# EAGLE design stm32hw07 (EAGLE 9.6.2)
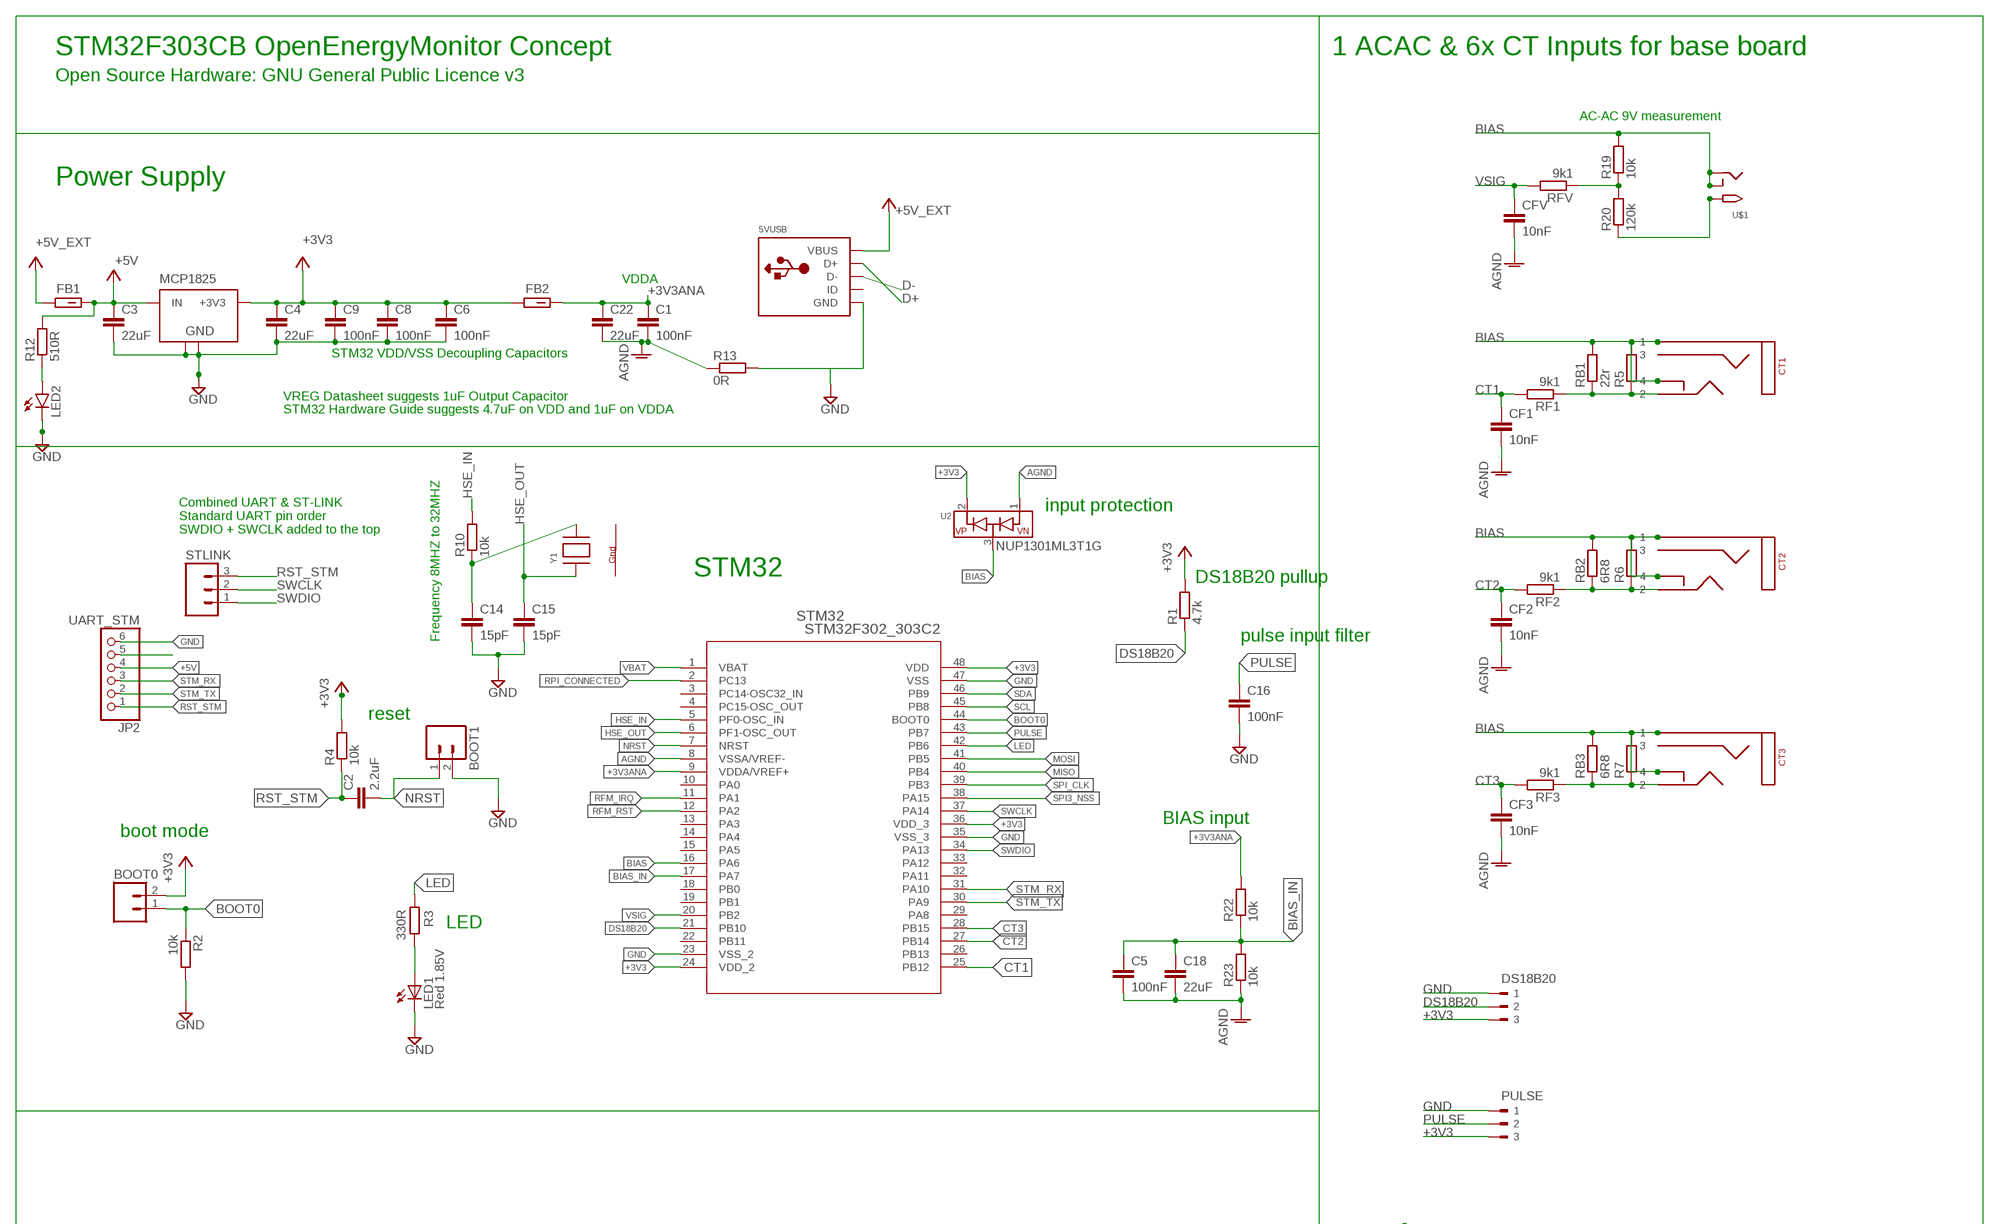
[diagram p0: schematic, sheet 1, part 1 of 3]
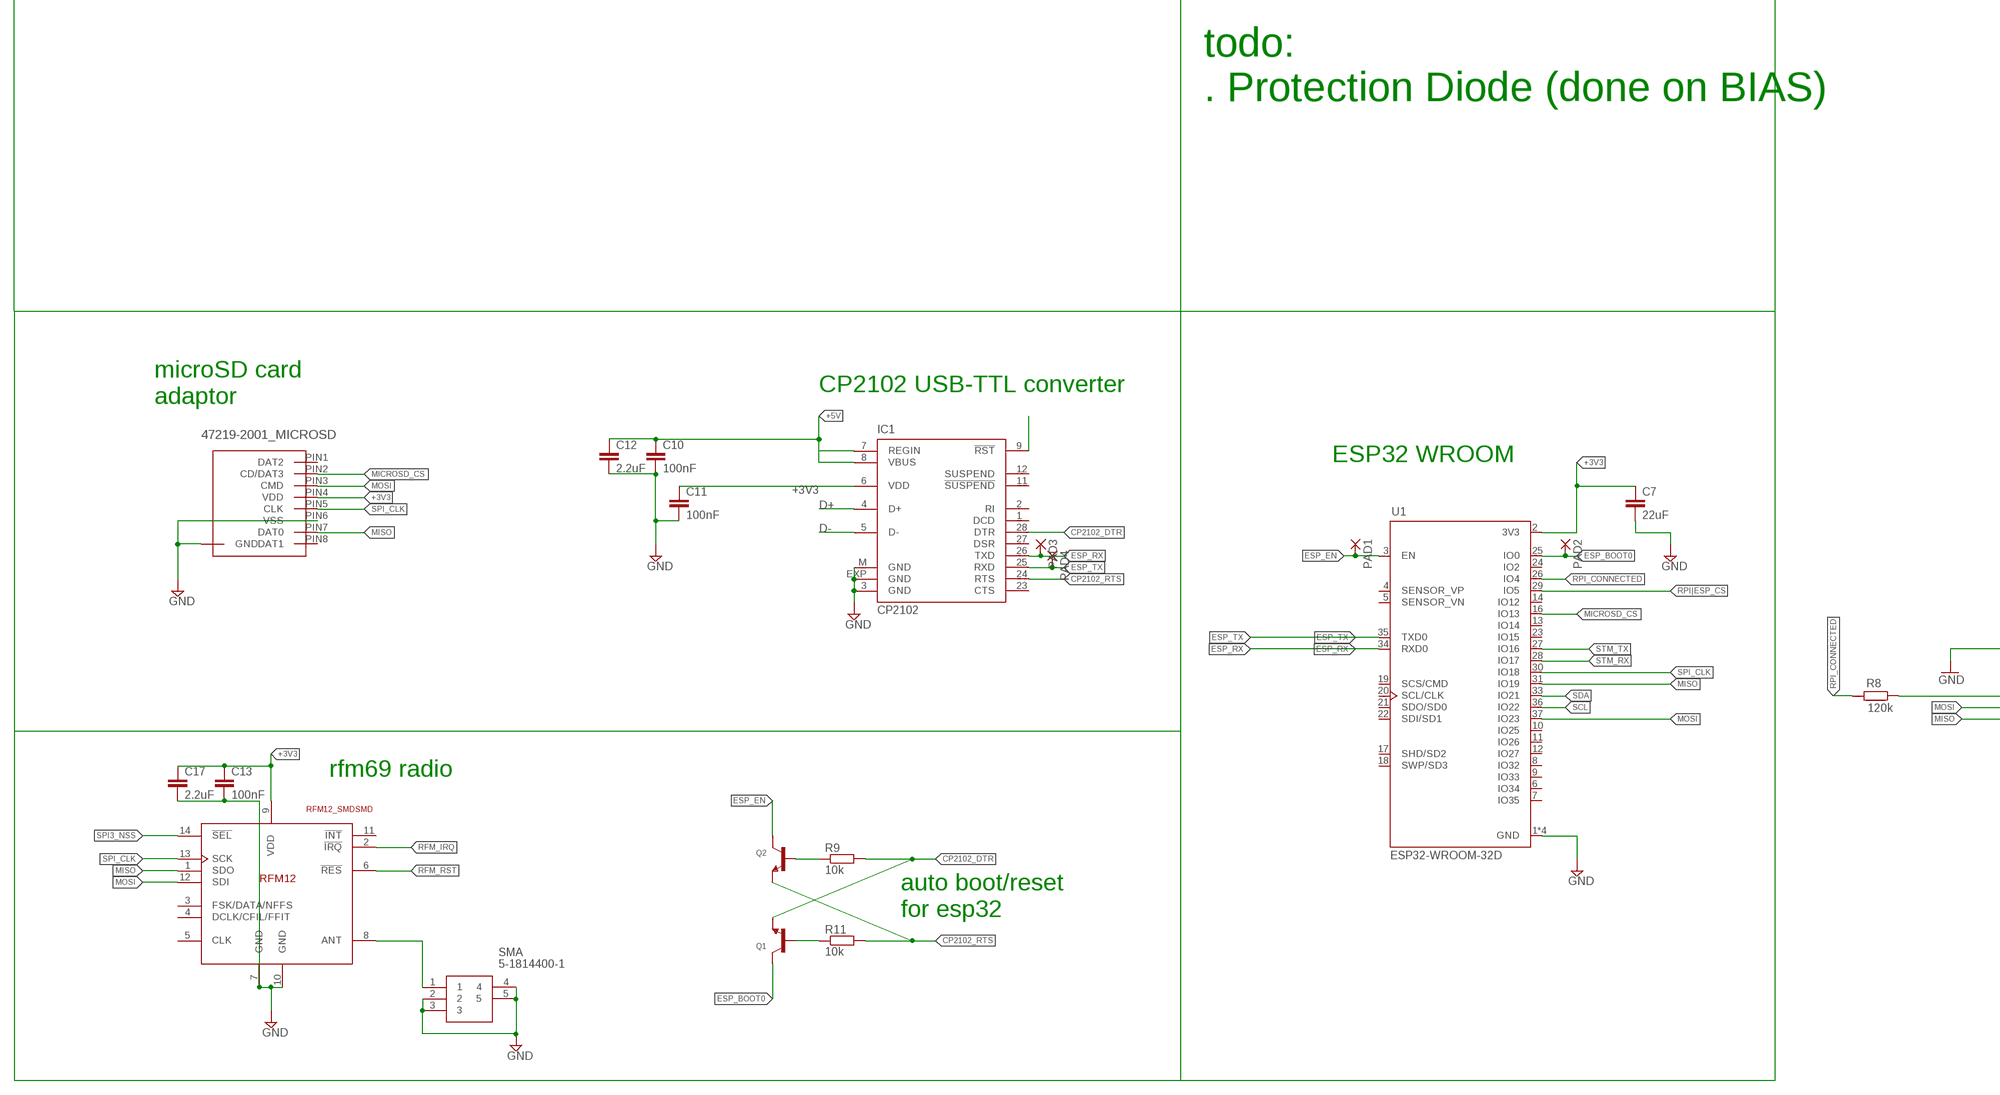
[diagram p1: schematic, sheet 1, part 2 of 3]
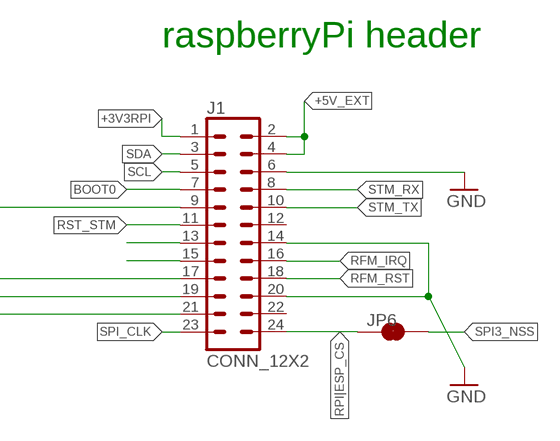
[diagram p2: schematic, sheet 1, part 3 of 3]

## Parts
5VUSB  USBMOLEX  [USB-MINIB-THM-MOLEX]
BOOT0  M02PTH  [1X02]
BOOT1  M02PTH  [1X02]
C1  100nF  C-EUC0603  [C0603]
C2  2.2uF  C-EUC0603  [C0603]
C3  22uF  C-EUC0805  [C0805]
C4  22uF  C-EUC0805  [C0805]
C5  100nF  C-EUC0603  [C0603]
C6  100nF  C-EUC0603  [C0603]
C7  22uF  C-EUC0805  [C0805]
C8  100nF  C-EUC0603  [C0603]
C9  100nF  C-EUC0603  [C0603]
C10  100nF  C-EUC0603  [C0603]
C11  100nF  C-EUC0603  [C0603]
C12  2.2uF  C-EUC0603  [C0603]
C13  100nF  C-EUC0603  [C0603]
C14  15pF  C-EUC0603  [C0603]
C15  15pF  C-EUC0603  [C0603]
C16  100nF  C-EUC0603  [C0603]
C17  2.2uF  C-EUC0603  [C0603]
C18  22uF  C-EUC0805  [C0805]
C22  22uF  C-EUC0805  [C0805]
CF1  10nF  C-EUC0805  [C0805]
CF2  10nF  C-EUC0805  [C0805]
CF3  10nF  C-EUC0805  [C0805]
CFV  10nF  C-EUC0805  [C0805]
CT1  STEREO_SMD  [STEREO_SMT]
CT2  STEREO_SMD  [STEREO_SMT]
CT3  STEREO_SMD  [STEREO_SMT]
DS18B20  180-3  [180-3]
FB1  0R  FBCHIP-0603(1608-METRIC)  [BEADC1608X95N]
FB2  0R  FBCHIP-0603(1608-METRIC)  [BEADC1608X95N]
IC1  CP2102  [MLP28]
J1  CONN_12X2  [2X12]
JP2  UART_STM  PINHD-1X6  [1X06]
JP6  JUMPER-SMT_2_NC_TRACE_NO-SILK  [SMT-JUMPER_2_NC_TRACE_NO-SILK]
LED1  Red 1.85V  LEDCHIP-LED0805  [CHIP-LED0805]
LED2  LEDCHIP-LED0805  [CHIP-LED0805]
MCP1825  MCP1825SOT-223-3  [SOT-223]
PAD1  1,6/0,8  [1,6/0,8]
PAD2  1,6/0,8  [1,6/0,8]
PAD3  1,6/0,8  [1,6/0,8]
PAD4  1,6/0,8  [1,6/0,8]
PULSE  180-3  [180-3]
Q1  TRANSISTOR_NPN  [SOT23-R]
Q2  TRANSISTOR_NPN  [SOT23-R]
R1  4.7k  R-EU_R0603  [R0603]
R2  10k  R-EU_R0603  [R0603]
R3  330R  R-EU_R0603  [R0603]
R4  10k  R-EU_R0603  [R0603]
R5  R-EU_0207/10  [0207/10]
R6  R-EU_0207/10  [0207/10]
R7  R-EU_0207/10  [0207/10]
R8  120k  R-EU_R0603  [R0603]
R9  10k  R-EU_R0603  [R0603]
R10  10k  R-EU_R0603  [R0603]
R11  10k  R-EU_R0603  [R0603]
R12  510R  R-EU_R0603  [R0603]
R13  0R  R-EU_R0603  [R0603]
R19  10k  R-EU_R0603  [R0603]
R20  120k  R-EU_R0603  [R0603]
R22  10k  R-EU_R0603  [R0603]
R23  10k  R-EU_R0603  [R0603]
RB1  22r  R-EU_R0603  [R0603]
RB2  6R8  R-EU_R0603  [R0603]
RB3  6R8  R-EU_R0603  [R0603]
RF1  9k1  R-EU_R0603  [R0603]
RF2  9k1  R-EU_R0603  [R0603]
RF3  9k1  R-EU_R0603  [R0603]
RFV  9k1  R-EU_R0603  [R0603]
SMA  5-1814400-1  [518144001]
STLINK  M03PTH  [1X03]
STM32  STM32F302_303C2  [LQFP48-7X7MM]
U1  ESP32-WROOM-32D  [MODULE_ESP32-WROOM-32D]
U2  ESDDIODEARRAY_SINGLE_UNIDIR  [SOT23-WIDE]
U$1  2.1MMJACKSMT  [DCJACK_2MM_SMT]
U$2  RFM12_SMDSMD  [RFM12]
U$3  47219-2001_MICROSD  [47219-2001_MICROSD]
Y1  XTAL-4-3225  [NX3225]

## Nets
+3V3: BOOT0.2 C4.1 C6.1 C7.1 C8.1 C9.1 C11.1 C13.1 C17.1 DS18B20.3 FB2.1 IC1.6(VDD) MCP1825.3(+3V3) PULSE.3 R1.2 R4.2 STM32.24(VDD_2) STM32.36(VDD_3) STM32.48(VDD) U1.2(3V3) U2.2(SUPPLYPIN) U$2.9(VDD) U$3.PIN4(VDD)
+3V3ANA: C1.1 C22.1 FB2.2 R22.2 STM32.9(VDDA/VREF+)
+3V3RPI: J1.1
+5V: C3.1 C10.1 C12.1 FB1.2 IC1.7(REGIN) IC1.8(VBUS) JP2.4 MCP1825.1(IN) R12.2
+5V_EXT: 5VUSB.VBUS FB1.1 J1.2 J1.4 ; supply symbol labelled +5V
AC: R20.1 U$1.PWR2(TIP)
ADC0: R19.1 R20.2 RFV.1
AGND: C1.2 C5.2 C18.2 C22.2 CF1.2 CF2.2 CF3.2 CFV.2 R13.1 R23.1 STM32.8(VSSA/VREF-) U2.1(GNDPIN)
BIAS: CT1.P$1 CT1.P$4 CT2.P$1 CT2.P$4 CT3.P$1 CT3.P$4 R5.2 R6.2 R7.2 R19.2 RB1.2 RB2.2 RB3.2 STM32.16(PA6) U2.3(IO) U$1.GND(RING) U$1.GNDBREAK(RING_SW)
BIAS_IN: C5.1 C18.1 R22.1 R23.2 STM32.17(PA7)
BOOT0: BOOT0.1 J1.7 R2.1 STM32.44(BOOT0)
CP2102_DTR: IC1.28(DTR) Q1.2(E) R9.2
CP2102_RTS: IC1.24(RTS) Q2.2(E) R11.2
CT1: CF1.1 RF1.2 STM32.25(PB12)
CT2: CF2.1 RF2.2 STM32.27(PB14)
CT3: CF3.1 RF3.2 STM32.28(PB15)
D+: 5VUSB.D+ IC1.4(D+)
D-: 5VUSB.D- IC1.5(D-)
DS18B20: DS18B20.2 R1.1 STM32.21(PB10)
ESP_BOOT0: PAD2.1(P) Q1.3(C) U1.25(IO0)
ESP_EN: PAD1.1(P) Q2.3(C) U1.3(EN)
ESP_RX: IC1.26(TXD) PAD3.1(P) U1.34(RXD0)
ESP_TX: IC1.25(RXD) PAD4.1(P) U1.35(TXD0)
GND: 5VUSB.GND BOOT1.2 C3.2 C4.2 C6.2 C7.2 C8.2 C9.2 C10.2 C11.2 C12.2 C13.2 C14.2 C15.2 C16.2 C17.2 DS18B20.1 IC1.3(GND) IC1.EXP(GND) IC1.M(GND) J1.6 J1.14 J1.20 JP2.6 LED1.C LED2.C MCP1825.2(GND) MCP1825.4(GND) PULSE.1 R2.2 R13.2 SMA.2 SMA.3 SMA.4 SMA.5 STM32.23(VSS_2) STM32.35(VSS_3) STM32.47(VSS) U1.1(GND) U1.15(GND) U1.38(GND) U1.39(GND) U$2.7(GND) U$2.10(GND) U$3.P$1(GND) U$3.P$2(GND) U$3.P$3(GND) U$3.P$4(GND) U$3.PIN6(VSS)
HSE_IN: R10.2 STM32.5(PF0-OSC_IN)
HSE_IN_: C14.1 R10.1 Y1.3(X2)
HSE_OUT: C15.1 STM32.6(PF1-OSC_OUT) Y1.1(X1)
LED: R3.2 STM32.42(PB6)
MICROSD_CS: U1.16(IO13) U$3.PIN2(CD/DAT3)
MISO: J1.21 STM32.40(PB4) U1.31(IO19) U$2.1(SDO) U$3.PIN7(DAT0)
MOSI: J1.19 STM32.41(PB5) U1.37(IO23) U$2.12(SDI) U$3.PIN3(CMD)
N$1: IC1.9(!RST)
N$2: CT1.P$2 R5.1 RB1.1 RF1.1
N$5: J1.9 ; supply symbol labelled GND
N$6: Q2.1(B) R9.1
N$7: Q1.1(B) R11.1
N$8: CT2.P$2 R6.1 RB2.1 RF2.1
N$9: J1.15
N$10: CT3.P$2 R7.1 RB3.1 RF3.1
N$11: J1.13
N$13: LED2.A R12.1
N$18: SMA.1 U$2.8(ANT)
N$19: JP2.5
N$41: LED1.A R3.1
NRST: BOOT1.1 C2.2 STM32.7(NRST)
PULSE: C16.1 PULSE.2 STM32.43(PB7)
RFM_IRQ: J1.16 STM32.11(PA1) U$2.2(!IRQ)
RFM_RST: J1.18 STM32.12(PA2) U$2.6(!RES)
RPI_CONNECTED: R8.2 STM32.2(PC13) U1.26(IO4)
RPI_CONNECTED_PR: J1.17 R8.1
RPI|ESP_CS: J1.24 JP6.1 U1.29(IO5)
RST_STM: C2.1 J1.11 JP2.1 R4.1 STLINK.3
SCL: J1.5 STM32.45(PB8) U1.36(IO22)
SDA: J1.3 STM32.46(PB9) U1.33(IO21)
SPI3_NSS: JP6.2 STM32.38(PA15) U$2.14(!SEL)
SPI_CLK: J1.23 STM32.39(PB3) U1.30(IO18) U$2.13(SCK) U$3.PIN5(CLK)
STM_RX: J1.8 JP2.3 STM32.31(PA10) U1.28(IO17)
STM_TX: J1.10 JP2.2 STM32.30(PA9) U1.27(IO16)
SWCLK: STLINK.2 STM32.37(PA14)
SWDIO: STLINK.1 STM32.34(PA13)
VBAT: STM32.1(VBAT)
VSIG: CFV.1 RFV.2 STM32.20(PB2)
Unconnected: 5VUSB.ID CT1.P$3 CT2.P$3 CT3.P$3 IC1.1(DCD) IC1.2(RI) IC1.11(!SUSPEND) IC1.12(SUSPEND) IC1.23(CTS) IC1.27(DSR) J1.12 J1.22 STM32.3(PC14-OSC32_IN) STM32.4(PC15-OSC_OUT) STM32.10(PA0) STM32.13(PA3) STM32.14(PA4) STM32.15(PA5) STM32.18(PB0) STM32.19(PB1) STM32.22(PB11) STM32.26(PB13) STM32.29(PA8) STM32.32(PA11) STM32.33(PA12) U1.4(SENSOR_VP) U1.5(SENSOR_VN) U1.6(IO34) U1.7(IO35) U1.8(IO32) U1.9(IO33) U1.10(IO25) U1.11(IO26) U1.12(IO27) U1.13(IO14) U1.14(IO12) U1.17(SHD/SD2) U1.18(SWP/SD3) U1.19(SCS/CMD) U1.20(SCL/CLK) U1.21(SDO/SD0) U1.22(SDI/SD1) U1.23(IO15) U1.24(IO2) U$2.3(FSK/DATA/NFFS) U$2.4(DCLK/CFIL/FFIT) U$2.5(CLK) U$2.11(!INT) U$3.PIN1(DAT2) U$3.PIN8(DAT1)

## Notes on the sheet
- STM32F303CB OpenEnergyMonitor Concept | 1 ACAC & 6x CT Inputs for base board
- Open Source Hardware: GNU General Public Licence v3
- AC-AC 9V measurement
- Power Supply
- VDDA
- STM32 VDD/VSS Decoupling Capacitors
- VREG Datasheet suggests 1uF Output Capacitor
- STM32 Hardware Guide suggests 4.7uF on VDD and 1uF on VDDA
- input protection
- Combined UART & ST-LINK
  Standard UART pin order
  SWDIO + SWCLK added to the top
- STM32
- DS18B20 pullup
- Frequency 8MHZ to 32MHZ | pulse input filter
- reset
- BIAS input
- boot mode
- LED
- todo:
  . Protection Diode (done on BIAS)
- CP2102 USB-TTL converter
- microSD card
  adaptor
- ESP32 WROOM
- raspberryPi header
- rfm69 radio
- auto boot/reset
  for esp32

## Power pins joined to a net without a drawn wire
G1: Y1.4(G1)
G2: Y1.2(G2)

## Library data of the parts
5VUSB = adafruit:USB: USB Connectors USBMINIB - Surface Mount Female Mini-B USB Connector 4UConnector: 06564 By microbuilder.eu Thru-hole RA Female Mini-B USB Connector 4UConnector: 18732 By ladyada.net
BOOT0 BOOT1 = SparkFun:M02: Header 2 Standard 2-pin 0.1" header. Use with straight break away headers (SKU : PRT-00116), right angle break away headers (PRT-00553), swiss pins (PRT-00743), machine pins (PRT-00117), and female headers (PRT-00115). Molex polarized connector foot print use with SKU : PRT-08233 with associated crimp pins and housings.
C1 C2 C5 C6 C8 C9 C14-C16 = resistor:C-EU: CAPACITOR, European symbol
C3 C4 C7 C10-C13 C17 C18 C22 CF1-CF3 CFV = rcl:C-EU: CAPACITOR, European symbol; SPICEPREFIX: C
CT1-CT3 = IotaWatt_parts:STEREO_SMD: 3.5mm Stereo Jack SMT
DS18B20 PULSE = con-weidmueller-sl35:180-3: WEIDMUELLER CLAMP CONNECTOR; OC_FARNELL: unknown; OC_NEWARK: unknown
FB1 FB2 = Filter:FB: Ferrite Bead - Generic; CATEGORY: Filter; SUB-CATEGORY: Ferrite bead
IC1 = silabs:CP210*: Single-Chip USB to UART Bridge Source: www.silabs.com .. CP2101.pdf / cp2102.pdf; MF: FARNELL; MPN: CP2102-GM; OC_FARNELL: 9282130; OC_NEWARK: 30K5635
J1 = SparkFun-Connectors:CONN_12X2: Multi connection point. Often used as Generic Header-pin footprint for 0.1 inch spaced/style header connections On any of the 0.1 inch spaced packages, you can populate with these: Break Away Headers - Straight <https://www.sparkfun.com/products/116> (PRT-00116) Break Away Male Headers - Right Angle <https://www.sparkfun.com/products/553> (PRT-00553) Female Headers <https://www.sparkfun.com/products/115> (PRT-00115) Break Away Headers - Machine Pin <https://www.sparkfun.com/products/117> (PRT-00117) Break Away Female Headers - Swiss Machine Pin <https://www.sparkfun.com/products/743> (PRT-00743)
JP2 = Connector:PINHD-1X6: PIN HEADER; CATEGORY: CONNECTOR; SUB-CATEGORY: PIN-HEADER
JP6 = SparkFun-Jumpers:JUMPER-SMT_2_NC_TRACE: Normally closed trace jumper This jumper has a trace between two pads so it's normally closed (NC). Use a razor knife to open the connection. For best results follow the IPC guidelines for cutting traces: Cutout at least 0.063 mm (0.005 in). Remove all loose material to clean up the cut area. Seal the cut with an approved epoxy. Reapply solder to reclose the connection.
LED1 = adafruit:LED: LED
LED2 = led:LED: LED
MCP1825 = SteelCaveRobotics-Power:MCP1825: MCP1825 3.3v LDO Linear Regulator
PAD1-PAD4 = wirepad:1,6/0,8: THROUGH-HOLE PAD
Q1 Q2 = microbuilder:TRANSISTOR_NPN: NPN Transistor Transistor (NPN) 500mA 45V - BC817 [Digikey: 568-1631-1-ND] Transistor (NPN) 500mA 45V - BC817,215 [Mouser: 771-BC817-T/R] SOT23-R - SOT23 footprint optimised for use with solder paste and reflow ovens. SOT23-W - SOT23 footprint optimised for hand-soldering (larger pads).
R1 R2 R4 R9-R13 R19 R20 R22 R23 RB1-RB3 RF1-RF3 RFV = resistor:R-EU_: RESISTOR, European symbol
R3 R8 = rcl:R-EU_: RESISTOR, European symbol
R5-R7 = rcl:R-EU_: RESISTOR, European symbol; SPICEPREFIX: R
SMA = 5-1814400-1 sma connector:5-1814400-1: SMA Connector Jack, Female Socket 50 Ohm Through Hole, Right Angle Solder Source: Datasheet <http://uk.rs-online.com/web/p/products/6163400>; ALLIED_NUMBER: 70084631; DESCRIPTION: SMA Connector Jack, Female Socket 50 Ohm Through Hole, Right Angle Solder; HEIGHT: 10.43mm; MANUFACTURER_NAME: TE Connectivity; MANUFACTURER_PART_NUMBER: 5-1814400-1; RS_PART_NUMBER: 6163400; RS_PRICE-STOCK: http://uk.rs-online.com/web/p/products/6163400
STLINK = SparkFun:M03: Header 3 Standard 3-pin 0.1" header. Use with straight break away headers (SKU : PRT-00116), right angle break away headers (PRT-00553), swiss pins (PRT-00743), machine pins (PRT-00117), and female headers (PRT-00115). Molex polarized connector foot print use with SKU : PRT-08232 with associated crimp pins and housings.
STM32 = stm32f303cb:STM32F302_303C2; MANUFACTURER_PART_NUMBER: stm32f302_303c2; VENDOR: STMicroelectronics
U1 = ESP32-WROOM-32D:ESP32-WROOM-32D: IC: SoC; GPIO, I2C, I2S, IR, SD, SDIO, SPI, UART; 2.7÷3.6VDC; 20dBm; AVAILABILITY: Unavailable; DESCRIPTION: IC: SoC; GPIO, I2C, I2S, IR, SD, SDIO, SPI, UART; 2.7÷3.6VDC; 20dBm; MF: Espressif Systems; MP: ESP32-WROOM-32D; PACKAGE: Module Espressif Systems; PRICE: None
U2 = microbuilder:ESDDIODEARRAY_SINGLE_UNIDIR: ESD Protection Diode Array - Single Channel Unidirectional SOT23-3 NUP1301,215 - Ultra low capacitance (0.6pF), Rev Voltage 80V, Forward Current: 215mA - Digikey: 568-6351-1-ND; MPN: NUP1301ML3T1G
U$1 = adafruit:2.1MMJACK: 2.1mm x 5.5mm THM DC jack with internal switch. Digikey part #PJ-102A, 4UCON part #05537 2.1mm x 5.5mm SMT DC jack with internal switch. Digikey part #PJ-002A-SMT, 4UCON part #03267 By microbuilder.eu & adafruit.com
U$2 = rfm12b _ rfm69cw:RFM12_SMD: RFM12 is a low costing ISM band transceiver module implemented with unique PLL. It works signal ranges from 315/433/868/915MHZ bands, comply with FCC, ETSI regulation. The SPI interface is used to communicate with microcontroller for parameter setting.
U$3 = MOLEX 47219-2001:47219-2001_MICROSD
Y1 = adafruit:XTAL-4: Classic 4-pin 3.2 x 2.5mm crystal

## Net classes
0 default: width 0.203 mm, drill 0.5 mm, clearance 0.152 mm
1 power: width 0.381 mm, drill 0.5 mm, clearance 0.254 mm
2 gnd: width 0.254 mm, drill 0.5 mm, clearance 0.254 mm

## Board
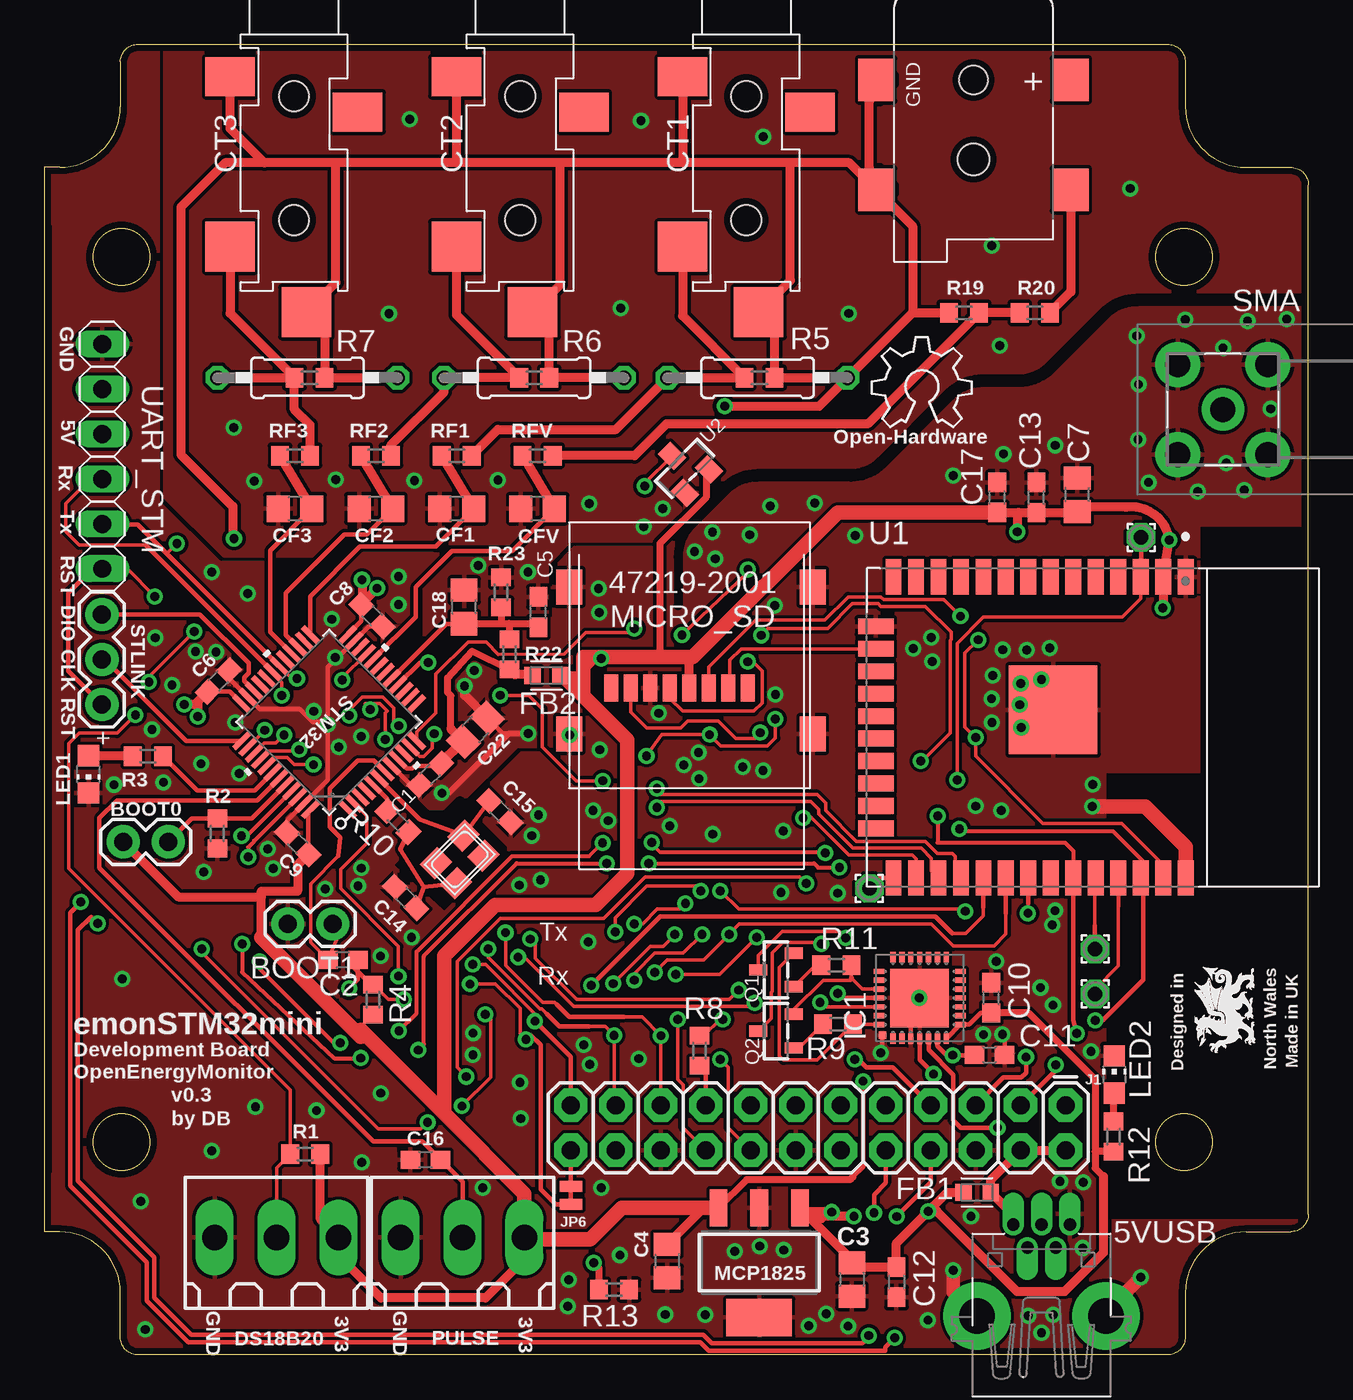
[diagram p3: board, top side]
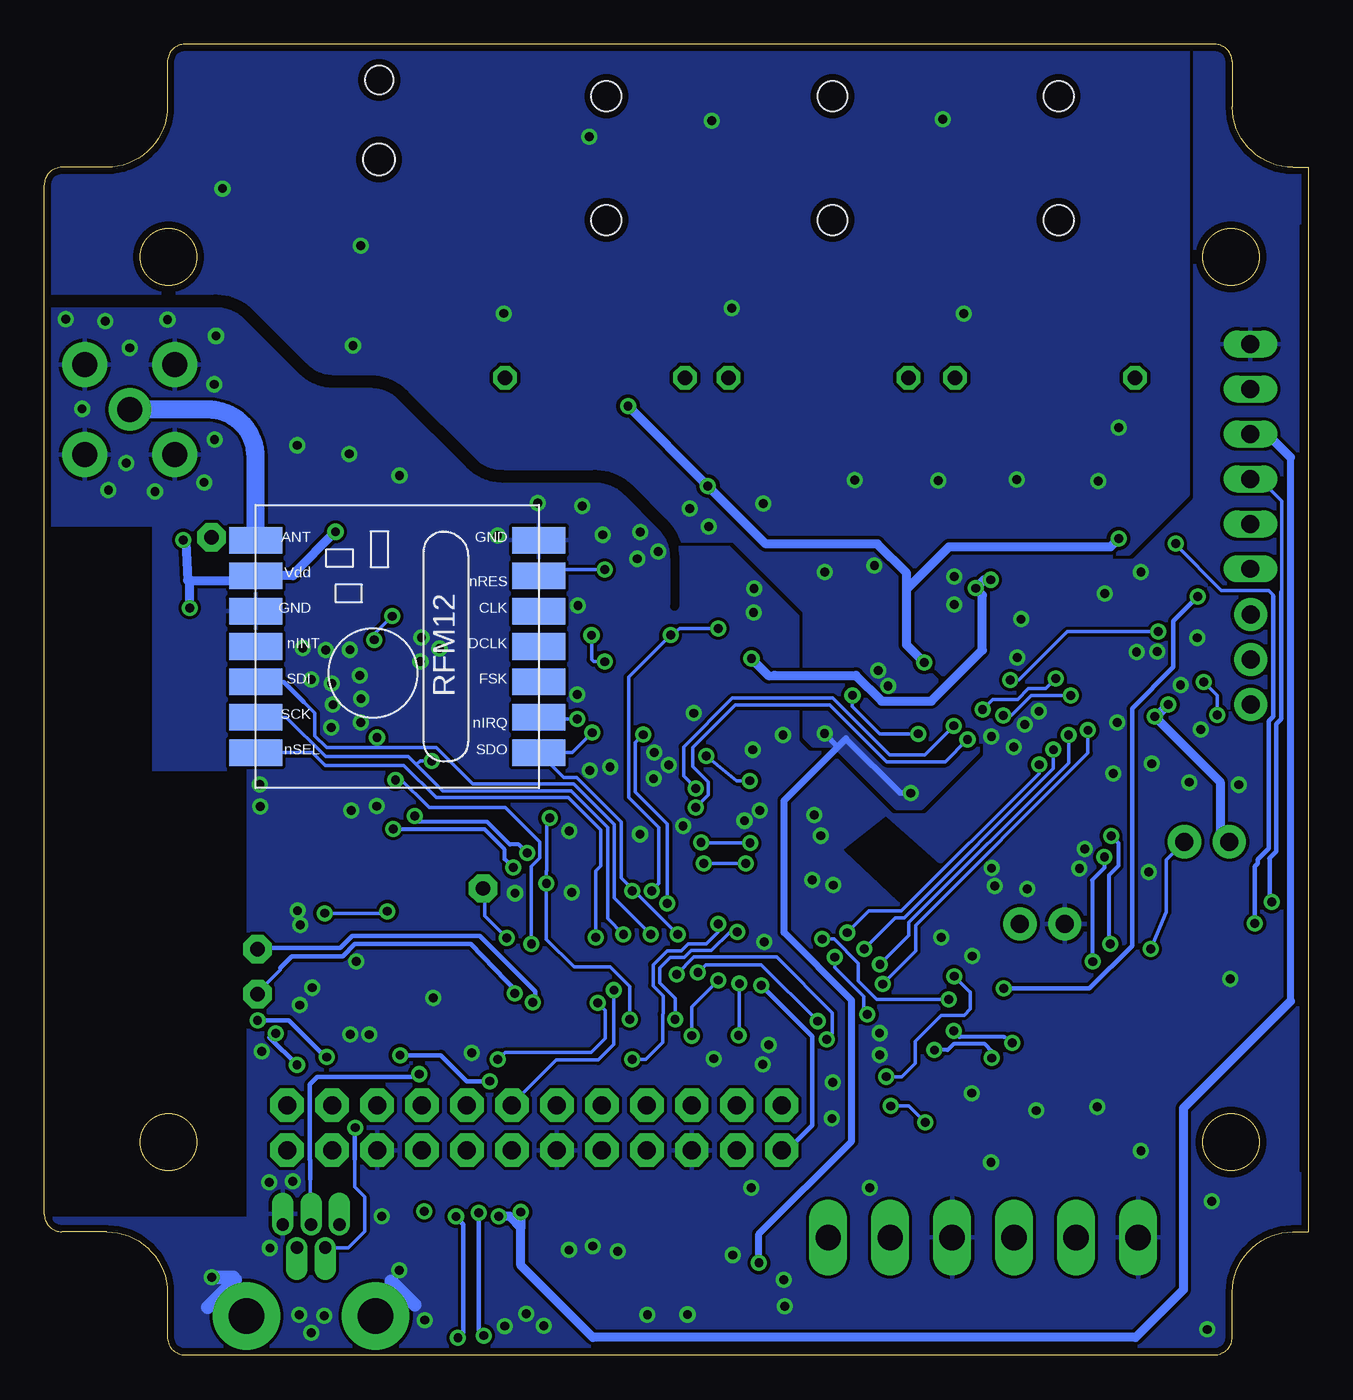
[diagram p4: board, bottom side, seen from below]

Size 71.39 x 74.04 mm. Coordinates in mm from the lower left corner, seen from the top.
Outline: 64.44,3.52 64.44,1 arc-90 63.44,0 5.3,0 arc-90 4.3,1 4.3,3.52 arc90 0.87,6.95 0,6.95 0,67.09 0.87,67.09 arc90 4.3,70.52 4.3,73.04 arc-90 5.3,74.04 63.44,74.04 arc-90 64.44,73.04 64.44,70.52 arc90 67.87,67.09 70.39,67.09 arc-90 71.39,66.09 71.39,7.95 arc-90 70.39,6.95 67.87,6.95 arc90 64.44,3.52
Outline: circle at 4.37,12.02 radius 1.61
Outline: circle at 4.37,62.02 radius 1.61
Outline: circle at 64.37,62.02 radius 1.61
Outline: circle at 64.37,12.02 radius 1.61
Copper layers (1*16): Top 0.035mm / dielectric 1.5mm / Bottom 0.035mm
Design rules "stmMini *": minimum track width 8mil, minimum drill 0.5mm, track to track 7mil, track to pad 7mil, pad to pad 7mil, via to via 7mil, smd to smd 6mil, copper to edge 15mil, drill to drill 8mil, minimum pad ring 10mil, minimum via ring 8mil, stop-mask expansion 4mil, vias tented up to drill 0.6mm, thermal gap 8mil
tRestrict: area 60,7.7 to 77.6,32.8; area 65.3,24.4 to 74.4,46.8; area 19.9,25.2 to 26,31.2; 13 lines
bRestrict: area 60,7.8 to 77.6,33; area 65.3,24.4 to 74.4,46.8; area 20.9,25.7 to 26.1,30.3; 13 lines

### Footprints (pad centres in the part's own frame; a part is rotated, then mirrored left to right if it is on the bottom)
USB-MINIB-THM-MOLEX = drill 0.7 offset: D+ 0,9.72; D- -0.8,8.42; GND 1.6,9.72; ID 0.8,8.42; VBUS -1.6,9.72 | drill 2 pad 3.81: GND1 -3.65,4.57; GND4 3.65,4.57
1X02 = drill 1.016 pad 1.88: 1 0,0; 2 2.54,0
C0603 = smd 1.1 x 1: 1 -0.85,0; 2 0.85,0
C0805 = smd 1.3 x 1.5: 1 -0.95,0; 2 0.95,0
STEREO_SMT = smd 2.8 x 2.2: P$1 -3.6,-2.4; P$3 3.6,-4.4 | smd 2.8 x 2.8: P$2 -3.6,-12; P$4 0.7,-15.7 | hole 1.7: 0,-3.5; 0,-10.5
180-3 = drill 1.422 long: 1 -3.5,0; 2 0,0; 3 3.5,0
BEADC1608X95N = smd 0.9 x 0.97: 1 -0.785,0 | smd 0.933 x 0.97: 2 0.769,0
MLP28 = smd 0.6 x 0.3: 1 -2.3,1.5; 2 -2.3,1; 3 -2.3,0.5; 4 -2.3,0; 5 -2.3,-0.5; 6 -2.3,-1; 7 -2.3,-1.5; 15 2.3,-1.5; 16 2.3,-1; 17 2.3,-0.5; 18 2.3,0; 19 2.3,0.5; 20 2.3,1; 21 2.3,1.5 | smd 0.3 x 0.6: 8 -1.5,-2.3; 9 -1,-2.3; 10 -0.5,-2.3; 11 0,-2.3; 12 0.5,-2.3; 13 1,-2.3; 14 1.5,-2.3; 22 1.5,2.3; 23 1,2.3; 24 0.5,2.3; 25 0,2.3; 26 -0.5,2.3; 27 -1,2.3; 28 -1.5,2.3 | smd 3.3 x 3.3: EXP 0,0 | smd 0.435 x 0.435: M -2.103,2.103
2X12 = drill 1.016 pad 1.88 octagon: 1 0,0; 2 0,2.54; 3 2.54,0; 4 2.54,2.54; 5 5.08,0; 6 5.08,2.54; 7 7.62,0; 8 7.62,2.54; 9 10.16,0; 10 10.16,2.54; 11 12.7,0; 12 12.7,2.54; 13 15.24,0; 14 15.24,2.54; 15 17.78,0; 16 17.78,2.54; 17 20.32,0; 18 20.32,2.54; 19 22.86,0; 20 22.86,2.54; 21 25.4,0; 22 25.4,2.54; 23 27.94,0; 24 27.94,2.54
1X06 = drill 1.016 long: 1 -6.35,0; 2 -3.81,0; 3 -1.27,0; 4 1.27,0; 5 3.81,0; 6 6.35,0
SMT-JUMPER_2_NC_TRACE_NO-SILK = smd 0.635 x 1.27: 1 -0.508,0; 2 0.508,0
CHIP-LED0805 = smd 1.2 x 1.2: A 0,-1.05; C 0,1.05
SOT-223 = smd 1 x 2.1: 1 -2.3,-3.1; 2 0,-3.1; 3 2.3,-3.1 | smd 3.7 x 2.1: 4 0,3.1
1,6/0,8 = drill 0.813 pad 1.6 octagon: 1 0,0
SOT23-R = smd 0.635 x 1.016: 1 -0.95,-1; 2 0.95,-1; 3 0,1
R0603 = smd 1 x 1.1: 1 -0.85,0; 2 0.85,0
0207/10 = drill 0.813 octagon: 1 -5.08,0; 2 5.08,0
518144001 = drill 1.4 pad 2.4: 1 0,0 | drill 1.4 pad 2.55: 2 -2.54,2.54; 3 -2.54,-2.54; 4 2.54,-2.54; 5 2.54,2.54
1X03 = drill 1.016 pad 1.88: 1 0,0; 2 2.54,0; 3 5.08,0
LQFP48-7X7MM = smd 1.194 x 0.305: 1 -4.25,2.75; 2 -4.25,2.25; 3 -4.25,1.75; 4 -4.25,1.25; 5 -4.25,0.75; 6 -4.25,0.25; 7 -4.25,-0.25; 8 -4.25,-0.75; 9 -4.25,-1.25; 10 -4.25,-1.75; 11 -4.25,-2.25; 12 -4.25,-2.75; 25 4.25,-2.75; 26 4.25,-2.25; 27 4.25,-1.75; 28 4.25,-1.25; 29 4.25,-0.75; 30 4.25,-0.25; 31 4.25,0.25; 32 4.25,0.75; 33 4.25,1.25; 34 4.25,1.75; 35 4.25,2.25; 36 4.25,2.75 | smd 0.305 x 1.194: 13 -2.75,-4.25; 14 -2.25,-4.25; 15 -1.75,-4.25; 16 -1.25,-4.25; 17 -0.75,-4.25; 18 -0.25,-4.25; 19 0.25,-4.25; 20 0.75,-4.25; 21 1.25,-4.25; 22 1.75,-4.25; 23 2.25,-4.25; 24 2.75,-4.25; 37 2.75,4.25; 38 2.25,4.25; 39 1.75,4.25; 40 1.25,4.25; 41 0.75,4.25; 42 0.25,4.25; 43 -0.25,4.25; 44 -0.75,4.25; 45 -1.25,4.25; 46 -1.75,4.25; 47 -2.25,4.25; 48 -2.75,4.25
MODULE_ESP32-WROOM-32D = smd 2 x 0.9: 1 -8.5,5.26; 2 -8.5,3.99; 3 -8.5,2.72; 4 -8.5,1.45; 5 -8.5,0.18; 6 -8.5,-1.09; 7 -8.5,-2.36; 8 -8.5,-3.63; 9 -8.5,-4.9; 10 -8.5,-6.17; 11 -8.5,-7.44; 12 -8.5,-8.71; 13 -8.5,-9.98; 14 -8.5,-11.25; 25 8.5,-11.25; 26 8.5,-9.98; 27 8.5,-8.71; 28 8.5,-7.44; 29 8.5,-6.17; 30 8.5,-4.9; 31 8.5,-3.63; 32 8.5,-2.36; 33 8.5,-1.09; 34 8.5,0.18; 35 8.5,1.45; 36 8.5,2.72; 37 8.5,3.99; 38 8.5,5.26 | smd 0.9 x 2: 15 -5.715,-12.25; 16 -4.445,-12.25; 17 -3.175,-12.25; 18 -1.905,-12.25; 19 -0.635,-12.25; 20 0.635,-12.25; 21 1.905,-12.25; 22 3.175,-12.25; 23 4.445,-12.25; 24 5.715,-12.25 | smd 5 x 5: 39 -1,-2.24
SOT23-WIDE = smd 1 x 1.27: 1 -0.95,-1; 2 0.95,-1; 3 0,1
DCJACK_2MM_SMT = smd 2.4 x 2: GND 0,-5.5; GNDBREAK 6.2,-5.5; PWR1 0,5.5; PWR2 6.2,5.5 | hole 1.6: 0,0 | hole 1.8: 4.5,0
RFM12 = smd 1.5 x 3: 1 -5,-10; 2 -3,-10; 3 -1,-10; 4 1,-10; 5 3,-10; 6 5,-10; 7 7,-10; 8 7,6; 9 5,6; 10 3,6; 11 1,6; 12 -1,6; 13 -3,6; 14 -5,6
47219-2001_MICROSD = smd 1.45 x 2: P$1 0,0; P$2 13.75,0; P$3 0,8.3; P$4 13.75,8.3 | smd 0.8 x 1.5: PIN1 10.08,2.6; PIN2 8.98,2.6; PIN3 7.88,2.6; PIN4 6.78,2.6; PIN5 5.68,2.6; PIN6 4.58,2.6; PIN7 3.48,2.6; PIN8 2.38,2.6
NX3225 = smd 1.4 x 1.2: 1 -1.1,-0.8; 2 1.1,-0.8; 3 1.1,0.8; 4 -1.1,0.8

### Placement (x,y rotation side)
5VUSB  56.32,-2.37 0 top
BOOT0  7,28.98 180 top
BOOT1  16.29,24.35 180 top
C1  21.8,32.8 225 top
C2  16.87,22.31 180 top
C3  45.61,4.26 270 top
C4  35.17,5.3 270 top
C5  27.91,41.96 90 top
C6  9.84,38.07 45 top
C7  58.33,48.59 90 top
C8  18.51,41.76 315 top
C9  14.31,28.89 135 top
C10  53.48,20.17 90 top
C11  53.38,16.94 0 top
C12  48.12,4.11 270 top
C13  56.03,48.43 90 top
C14  20.41,25.83 135 top
C15  25.73,30.69 315 top
C16  21.53,11.02 180 top
C17  53.81,48.44 90 top
C18  23.71,42.25 90 top
C22  24.35,35.32 45 top
CF1  23.3,47.8 180 top
CF2  18.73,47.8 180 top
CF3  14.16,47.8 180 top
CFV  27.86,47.8 180 top
CT1  39.65,74.6 0 top
CT2  26.87,74.6 0 top
CT3  14.1,74.6 0 top
DS18B20  13.12,6.63 0 top
FB1  52.67,9.18 180 top
FB2  28.35,38.39 180 top
IC1  49.44,20.16 90 top
J1  57.68,14.1 180 top
JP2  3.28,50.76 90 top
JP6  29.75,9.01 270 top
LED1  2.5,32.79 180 top
LED2  60.43,15.84 0 top
LOGO1  OSHW_LOGO_6MILX0200-NT  [OSHW_6X200_NOTEXT]  46.72,52.41 0 top
MCP1825  40.38,5.21 180 top
PAD1  61.94,46.18 0 top
PAD2  46.6,26.35 0 top
PAD3  59.34,22.93 0 top
PAD4  59.34,20.39 0 top
PULSE  23.62,6.63 0 top
Q1  41.32,21.75 90 top
Q2  41.33,18.29 90 top
R1  14.74,11.33 0 top
R2  9.77,29.45 270 top
R3  5.85,33.83 0 top
R4  18.57,20.07 270 top
R5  40.29,55.2 0 top
R6  27.66,55.2 0 top
R7  14.86,55.2 0 top
R8  37,17.18 90 top
R9  44.83,18.69 0 top
R10  19.97,30.13 135 top
R11  44.73,22.01 0 top
R12  60.39,12.34 270 top
R13  32.17,3.69 0 top
R19  51.94,58.87 180 top
R20  55.94,58.87 180 top
R22  26.28,39.58 270 top
R23  25.8,43.08 270 top
RB1  40.39,55.2 0 top
RB2  27.67,55.2 0 top
RB3  14.98,55.2 0 top
RF1  23.3,50.8 180 top
RF2  18.73,50.8 180 top
RF3  14.16,50.8 180 top
RFV  27.86,50.8 180 top
SMA  66.56,53.4 270 top
STLINK  3.25,41.82 270 top
STM32  16.09,35.74 135 top
U1  59.21,35.44 270 top
U2  36.16,50.07 45 top
U$1  52.48,72.02 270 top
U$2  53.45,39.02 90 bottom
U$3  29.64,35.07 0 top
Y1  23.46,27.99 225 top

### Tracks (layer width: path | path; a pad name or v marks a point on that pad's centre or on a via)
+3V3  (via drill 0.5)
  Top 0.203: R4.2 17.87,18.52 17.87,18.34 17.87,17.97 | v31.45,39.34 31.25,39.15 30.88,39.15
  Top 0.254: C8.1 17.91,41.45 STM32.24 | C6.1 10.47,37.47 STM32.36 | STM32.48 14.91,30.68 C9.1 | IC1.6 50.44,17.45 50.95,16.93 v51.3,16.93 52.52,16.93 C11.1 | v46.24,15.46 46.24,10.62 45.66,10.04
  Top 0.406: 45.66,10.04 45.51,9.89 39.66,9.89 MCP1825.3 | U2.2 37.38,49.88 37.38,48.44 34.77,45.83 34.77,39.47 34.72,39.41
  Top 0.508: 27.22,6.53 PULSE.3 27.12,5.4 24.93,3.21 19.01,3.21 16.62,5.6 DS18B20.3 15.59,7.66 R1.2 | MCP1825.3 37.23,8.31 C4.1 | 12.26,23.58 12.26,25.88 | 12.26,25.88 12.26,26.21 14.31,26.21 14.31,27.69 C9.1 | v7.91,36.74 8.51,36.74 C6.1 8.68,36.91 v8.68,36.06 | BOOT0.2 7.57,25.88 12.26,25.88 | v18.79,43.31 17.91,42.42 C8.1 17.94,42.4 v17.94,43.79 | C17.1 55.01,47.59 | 55.01,47.59 C13.1 58.27,47.58 C7.1 58.58,47.88 61.1,47.88 arc-90 v63.54,46.04 63.19,43.96 U1.2 63.2,42.22 v63.17,42.2 | 55.01,47.59 54.94,47.52 v54.94,46.5 | FB2.1 30.12,38.39 30.88,39.15 | U$3.PIN4 36.42,39.38 36.39,39.41
  Top 0.813: MCP1825.3 32.6,8.31 30.82,6.53 27.22,6.53 | PULSE.3 27.12,9.09 22.57,13.64 | 22.57,13.64 17.87,18.34 | 17.87,17.97 12.26,23.58 | 22.57,13.64 22.57,22.52 25.46,25.41 31.15,25.41 32.92,27.19 32.92,34.74 30.45,37.21 | 30.45,37.21 30.45,39.41 34.72,39.41 36.39,39.41 36.63,39.41 44.8,47.59 C17.1 | 30.45,37.21 29.28,38.39 FB2.1
  Bottom 0.254: v51.3,16.93 48.99,16.93 47.52,15.46 v46.24,15.46
  Bottom 0.508: v7.91,36.74 8.58,36.06 v8.68,36.06 4.98,32.37 4.98,29.5 BOOT0.2 | v17.94,43.79 18.32,43.79 v18.79,43.31 18.41,42.92 18.41,39.81 21.29,36.94 24.11,36.94 25.56,38.39 30.16,38.39 30.46,38.36 v31.45,39.34 | v54.94,46.5 57.29,44.15 57.29,44.05 57.33,44.02 U$2.9 59.71,43.76 63.3,43.76 | v63.54,46.04 63.41,45.92 63.3,43.76 | v63.17,42.2 63.17,43.63 63.3,43.76
+3V3ANA
  Top 0.254: C1.1 22.18,33.4 | STM32.9 20.48,33.11 20.78,33.11 20.92,33.25 22.03,33.25 22.18,33.4 | C22.1 23.42,34.64 22.18,33.4
  Top 0.406: 22.96,35.36 22.96,37.24 22.77,37.43 22.77,38.24 24.16,39.75 R22.2
  Top 0.508: C1.1 23.65,34.64 C22.1 22.96,35.36 | R22.2 26.58,38.43 27.54,38.43 FB2.2
+5V  (via drill 0.5)
  Top 0.203: v44.47,8.07 43.96,7.55 43.43,7.55
  Top 0.254: IC1.7 IC1.8 52.24,18.66 52.9,19.32 C10.1
  Top 0.406: C10.1 55.59,19.32 59.34,15.57 59.34,11.49 | 59.82,10.06 59.34,10.54 59.34,11.49 | R12.2 59.35,11.49 59.34,11.49
  Top 0.508: 43.16,7.83 43.43,7.55 45.61,5.38 C3.1 45.86,4.96 C12.1 48.12,6.3 v49.93,8.11 | FB1.2 51,9.18 v49.93,8.11 | v44.47,8.07 42.92,8.07 | 42.92,8.07 MCP1825.1 | v45.73,7.83 43.16,7.83 | 43.16,7.83 42.92,8.07 | v49.93,8.11 50.41,8.11 54.92,3.59 57.62,3.59 59.82,5.79 59.82,10.06
  Bottom 0.406: 1.01,50.71 1.01,19.98
  Bottom 0.508: JP2.4 2.33,52.03 1.01,50.71 | 1.01,19.98 7.06,13.93 7.06,3.68 9.76,0.99 40.4,0.99 44.47,5.05 v44.47,8.07 44.47,7.18 45.11,7.83 v45.73,7.83
+5V_EXT
  Top 0.203: 5VUSB.VBUS 54.72,7.91
  Top 0.508: J1.2 J1.4 53.46,9.88 FB1.1 54.72,7.91
AC
  Top 0.508: U$1.PWR2 57.98,60.06 R20.1
ADC0
  Top 0.508: R20.2 R19.1 46.5,52.58 35.13,52.58 33.34,50.8 RFV.1
AGND  (via drill 0.5)
  Top 0.254: v27.32,35.11 25.9,35.11 C22.2 | STM32.8 20.7,32.19 C1.2
  Top 0.305: v22.46,31.73 22.84,31.73 26.22,35.11 v27.32,35.11
  Top 0.406: v31.03,5.19 31.32,4.9 R13.1
  Top 0.508: C22.2 23.74,37.27 v23.74,37.79
  Bottom 0.305: v27.32,35.11 26.57,34.35 | 26.12,34.79 23.06,31.73 v22.46,31.73
  Bottom 0.406: v31.03,5.19 31.03,6.83 25.79,12.07 25.79,20.03 29.61,23.85 29.61,31.31 26.57,34.35 26.12,34.79
  other vias: 45.44,58.83 34.94,47.81 25.62,49.42 20.91,49.4 16.47,49.45 11.86,49.37 33.86,46.79 27.32,44.22 24.5,44.58 30.78,48.09 20.64,69.8 33.7,69.73 40.61,68.83 53.52,62.67 53.95,57.01 61.32,65.89 32.55,59.14 19.47,58.83 10.71,52.39 24.28,38.66
  pour Top (isolate 0.203): 6.84,76.66 6.84,48.47 10.16,45.15 19.95,45.15 21.48,43.62 21.48,38.64 18.59,35.75 18.59,34.06 21.77,30.88 23.16,30.88 26.69,34.41 27.89,34.41 28.37,34.88 28.37,44.68 29.67,45.99 35.46,45.99 39.26,49.79 47,49.79 52.01,54.81 56.12,54.81 60.77,59.46 71.9,59.46 73.07,60.63 73.07,75.98 73.91,76.82
  pour Bottom (isolate 0.203): 6.82,76.68 6.82,48.59 10.14,45.27 19.93,45.27 21.56,43.64 21.56,38.66 18.67,35.77 18.67,34.08 21.85,30.9 23.24,30.9 26.76,34.43 27.97,34.43 28.45,34.9 28.45,42 32.45,46.01 35.53,46.01 39.33,49.81 47.08,49.81 52.09,54.82 56.2,54.82 60.85,59.48 71.97,59.48 73.15,60.65 73.15,76 73.98,76.83
BIAS  (via drill 0.5)
  Top 0.203: U2.3 33.91,49.24 v33.91,49.08
  Top 0.254: STM32.16 21.22,39.11 v21.69,39.11 | R5.2 45.35,55.19 45.34,55.2 | CT1.P$4 41.24,58.01 | 28.52,57.95 CT2.P$4 | U$1.GNDBREAK 46.98,66.66 46.6,67.04 | U$1.GND 46.98,71.19 46.6,70.81
  Top 0.508: 45.35,55.19 43.76,53.59 v38.42,53.59 | R5.2 49.03,58.87 | 49.03,58.87 R19.2 | 49.03,58.87 49.03,63.77 U$1.GNDBREAK 45.46,67.34 42.14,67.34 | 45.34,55.2 RB1.2 41.24,58.01 | R6.2 RB2.2 28.52,57.95 | 46.6,67.04 46.6,70.81 | 42.14,67.34 36.09,67.34 | 36.09,67.34 29.13,67.34 | 29.13,67.34 23.43,67.34 | 23.43,67.34 16.47,67.34 | 16.47,67.34 12.43,67.34 | CT3.P$1 10.5,69.27 12.43,67.34 | CT1.P$1 36.05,67.38 36.09,67.34 | CT2.P$1 23.27,67.49 23.43,67.34 | 16.47,67.34 16.47,60.57 CT3.P$4 15.83,57.87 RB3.2 R7.2 | CT2.P$4 29.13,60.46 29.13,67.34 | CT1.P$4 42.14,60.7 42.14,67.34 | 12.43,67.34 10.21,67.34 7.71,64.83 7.71,50.87 10.66,47.93 10.66,46.17 v10.71,46.11
  Bottom 0.508: v38.42,53.59 v33.91,49.08 30.64,45.81 24.34,45.81 22.68,44.16 22.68,43.41 | 22.68,43.41 22.61,43.33 20.3,45.64 11.19,45.64 v10.71,46.11 | 22.68,43.41 22.68,40.11 v21.69,39.11
BIAS_IN
  Top 0.254: C18.1 22.7,41.3 STM32.17
  Top 0.406: C18.1 23.74,41.32 25.79,41.32 | C5.1 27.7,41.32 26.25,41.32 | 25.79,41.32 26.25,41.32 | R23.2 25.8,41.34 25.79,41.32 | R22.1 26.28,41.29 26.25,41.32
BOOT0  (via drill 0.5)
  Top 0.203: v8.9,22.93 8.94,22.97 8.94,22.69 18.86,12.77 21.27,12.77 v21.64,13.14 | v23.59,14.06 25.21,15.68 25.21,19.14 25.11,19.23 v24.9,19.23 | v26.75,22.47 27.11,22.47 29.89,19.69 39.93,19.69 v40.13,19.89 | v45.77,16.68 45.88,16.79
  Top 0.254: STM32.44 11.71,30.3 R2.1 8.32,30.3 BOOT0.1 | J1.7 47.91,16.25 46.41,16.25 45.88,16.79
  Bottom 0.203: BOOT0.1 8.02,27.97 8.02,25.02 v8.9,22.93 | v21.64,13.14 22.57,14.06 v23.59,14.06 | v24.9,19.23 25.11,19.45 25.11,20.24 26.75,21.88 v26.75,22.47 | v40.13,19.89 39.71,19.47 39.71,17.87 40.49,17.09 45.37,17.09 v45.77,16.68
CP2102_DTR
  Top 0.203: IC1.28 45.71,18.66 R9.2 43.64,16.66 41.74,16.66 41.51,16.89 41.51,21.88 Q1.2
CP2102_RTS
  Top 0.203: IC1.24 46.2,20.66 45.62,21.25 45.62,21.33 45.58,21.33 | 45.58,21.33 R11.2 | Q2.2 42.33,19.51 43.98,21.16 45.54,21.16 45.54,21.33 45.58,21.33
CT1
  Top 0.254: CF1.1 22.1,45.65 17.83,45.65 15.03,42.85 STM32.25
  Top 0.508: CF1.1 RF1.2
CT2
  Top 0.254: CF2.1 18.21,46.33 16.94,46.33 13.64,43.03 13.64,40.67 STM32.27
  Top 0.508: CF2.1 RF2.2
CT3
  Top 0.254: STM32.28 12.77,40.83 12.77,45.45 CF3.1
  Top 0.508: RF3.2 CF3.1
D+  (via drill 0.5)
  Top 0.254: IC1.4 49.44,16.66 50.22,15.88 v50.22,15.86
  Bottom 0.203: 5VUSB.D+ 56.39,7.42 56.35,7.46 56.35,9.92
  Bottom 0.254: 56.35,9.92 56.35,10.99 56.41,11.04 56.41,15.27 55.96,15.71 50.53,15.71 50.39,15.85 50.31,15.96 v50.22,15.86
D-  (via drill 0.5)
  Top 0.254: IC1.5 49.94,17.22 51.33,15.83 51.33,13.26 51.75,12.83 v53.83,12.83
  Bottom 0.203: 53.87,11.04 53.87,9.5 53.3,8.93 53.3,6.98 54.22,6.05 5VUSB.D-
  Bottom 0.254: v53.83,12.83 53.87,12.8 53.87,11.04
DS18B20  (via drill 0.5)
  Top 0.203: STM32.21 16.84,38.26 v16.84,38.12 | v8.47,40.86 5.91,38.3 v5.91,38.02 | v5.15,36.16 4.12,35.12 1.97,35.12 1.39,34.54 1.39,27.46 13.89,14.96 R1.1 13.12,10.56 DS18B20.2
  Bottom 0.203: v16.84,38.12 16.36,38.12 13.62,40.86 v8.47,40.86 | v5.91,38.02 5.15,37.25 v5.15,36.16
ESP_BOOT0  (via drill 0.5)
  Top 0.203: Q1.3 40.33,22.58 41.67,23.92 44.9,23.92 v45.26,23.56
  Top 0.254: PAD2.1 47.2,26.94 U1.25
  Bottom 0.203: v45.26,23.56 46.5,24.8 46.5,26.25 PAD2.1
ESP_EN  (via drill 0.5)
  Top 0.203: Q2.3 41.06,19.02 41.06,20.47 41.12,20.54 41.12,22.72 41.7,23.3 42.95,23.3 42.96,23.29 43.88,23.29 v43.88,23.21 | v51.55,32.48 51.55,40.2 53.03,41.68 60.88,41.68 61.93,42.73 61.93,44.12
  Top 0.254: 61.93,44.12 61.93,43.99 | 61.93,43.99 U1.3 | PAD1.1 61.94,44 61.93,43.99
  Bottom 0.203: v43.88,23.21 43.88,27.6 43.41,28.07 43.41,28.96 45.36,30.92 49.66,30.92 51.37,32.62 51.41,32.62 v51.55,32.48
ESP_RX  (via drill 0.5)
  Top 0.203: v43.81,19.92 44.07,19.66 IC1.26 | PAD3.1 59.33,23.22 | 59.33,24.26 59.33,26.6 59.39,26.66
  Top 0.229: U1.34 59.39,26.66
  Top 0.254: 59.33,23.22 59.33,24.26
  Bottom 0.203: PAD3.1 58.97,22.93 58.91,22.99
  Bottom 0.254: 58.91,22.99 54.68,22.99 54,23.66 46.8,23.66 43.66,20.52 43.66,20.07 v43.81,19.92
ESP_TX  (via drill 0.5)
  Top 0.203: PAD4.1 59.34,20.66 60.66,21.98 60.66,25.34
  Top 0.229: U1.35 60.66,25.34
  Top 0.254: IC1.25 44.76,20.16 44.84,20.24 v44.82,20.43
  Bottom 0.203: 58.06,21.86 58.06,21.75 59.39,20.43 PAD4.1
  Bottom 0.254: 58.06,21.86 57.41,22.52 54.54,22.52 53.85,23.2 47.31,23.2 44.62,20.43 v44.82,20.43
GND  (via drill 0.5)
  Top 0.254: C8.2 18.32,41.16 STM32.23 16.01,38.85 v16.01,35.62 | C6.2 10.44,38.21 STM32.35 12.16,36.49 14.42,36.49 15.15,35.75 15.88,35.75 v16.01,35.62 | C9.2 13.71,30.18 STM32.47 16.01,32.49 v16.01,35.62 | IC1.3 48.94,19.66 IC1.EXP | IC1.M 47.34,17.15 v47.24,17.06 | v54.11,18.11 54.23,17.98 C11.2
  Top 0.508: 51.33,3.54 52.46,2.41 52.5,2.41
  Top 0.762: v61.93,4.38 60.36,2.81 60.36,2.12 | v51.33,4.78 51.33,3.54
  Top 0.813: U1.38 64.47,28.68 62.17,30.98 v59.19,30.98
  Bottom 0.254: v47.24,17.06 46.97,17.06
  Bottom 0.762: 51.79,4.14 50.48,2.83 | 62.16,2.68 60.59,4.25 60.72,4.38 v61.93,4.38
  other vias: 20,42.39 12.63,28.58 12.93,27.47 8.54,39.73 3.94,32.21 17.89,27.49 27.54,29.33 40.41,6.14 41.75,5.92 39,5.86 56.98,2.26 55.57,2.22 56.32,1.24 49.41,20.16 15.21,36.36 53.04,18.09 53.77,22.23 56.26,20.74 56.97,19.76 59.22,32.22 43.51,48.11 41,47.95 39.84,46.33 54.17,50.9 57.09,51.38 51.33,49.68 67.76,48.86 66.76,50.38 65.13,48.78 62.36,49.29 61.77,51.71 61.8,54.83 61.69,57.57 64.43,58.49 66.57,56.89 67.95,58.41 70.18,58.51 69.25,53.44 55.15,37.94 55.08,36.73 55.17,35.43 53.52,35.72 53.5,37.06 53.56,38.38 24.22,18.17 24.21,16.95 30.72,23.33 29.67,35.01 36.12,33.33 37.89,44.97 36.95,34.02 36.98,32.55 7.22,37.85 9.45,44.22 6.27,40.51 28.03,26.82 44.17,2.33 49.9,1.97 31.3,43.28 56.31,38.15 56.79,39.93 55.49,39.82 54.12,39.83 44.8,26.08 40.59,33.02 30.81,16.42 30.47,17.5 35.06,2.28 26.87,15.4 26.9,13.35 24.76,9.43 17.92,10.88 15.37,13.8 11.93,14.01 4.4,21.23 9.01,27.29 8.85,33.4 6.73,32.35 6.08,35.32 9.7,39.71 20.01,43.96 17.9,34.94 19.01,14.78 15.87,26.33 5.71,1.43 43.18,1.64 37.32,2.27 45.39,1.62 37.74,46.49 41.29,37.31 41.25,42.34 45.79,46.28 50.08,40.53 50.14,39.16 49.07,39.91 18.99,22.53 36.72,45.38 34.7,36.25 27.91,30.49 26.83,26.54 20.74,23.59 30.99,30.76 31.84,30.18 31.37,34.19 35.31,29.88 37.74,29.41 41.74,29.59 41.61,26.13 33.58,16.73 56.93,24.29 57.08,25.09 54.04,30.74 52.61,31 39.44,33.2 31.33,41.93 31.46,9.43 29.62,4.24 32.51,5.64 29.56,2.74 9.45,11.53 16.63,34.33 17.72,26.48 59.11,17.14 11.5,43 16.23,41.56 16.44,39.4 11.02,32.85 10.8,35.72 5.45,8.67 57.36,9.8 58.68,9.75 58.64,6.03 52.33,7.84
  pour Top (rank 2): 0.56,10.2 arc90 -1.65,6.95 0.87,6.95 arc-90 4.3,3.52 4.3,1 arc90 5.3,0 63.44,0 arc90 64.44,1 64.44,3.52 arc-90 67.87,6.95 70.39,6.95 arc90 71.39,7.95 71.39,66.09 arc90 70.39,67.09 67.87,67.09 arc-90 64.44,70.52 64.44,73.04 arc90 63.44,74.04 5.3,74.04 arc90 4.3,73.04 4.3,70.52 arc-90 0.87,67.09 -1.65,67.09 arc90 0.56,63.89
  pour Bottom (rank 2): 0.63,10.25 arc90 -1.58,7 0.94,7 arc-90 4.37,3.57 4.37,1.05 arc90 5.37,0.05 63.51,0.05 arc90 64.51,1.05 64.51,3.57 arc-90 67.94,7 70.46,7 arc90 71.46,8 71.46,66.14 arc90 70.46,67.14 67.94,67.14 arc-90 64.51,70.57 64.51,73.09 arc90 63.51,74.09 5.37,74.09 arc90 4.37,73.09 4.37,70.57 arc-90 0.94,67.14 -1.58,67.14 arc90 0.63,63.95
HSE_IN
  Top 0.254: R10.2 19.37,31.4 STM32.5
HSE_IN_
  Top 0.254: Y1.3 21.43,26.45 | 21.43,26.45 20.1,28.56 R10.1 | C14.1 21.43,26.45
HSE_OUT
  Top 0.254: STM32.6 18.91,32.54 21.21,30.24 Y1.1 C15.1
LED
  Top 0.254: R3.2 8.63,31.89 11.88,31.89 STM32.42
MICROSD_CS
  Top 0.203: U$3.PIN2 38.71,37.76 38.71,39.25 39.35,39.89 U1.16
MISO  (via drill 0.5)
  Top 0.203: 28.39,19.25 28.1,19.54 27.98,19.54 25.43,22.09 25.08,22.44 v25.08,22.93 | STM32.40 12.71,34.13 14.34,34.13 v14.39,34.19 | v35.61,23.75 34.94,23.08 34.23,23.08 v32.13,20.97 | J1.21 32.18,14.2 v32.18,18.05 31.68,18.55 30.76,18.55 | 55.58,25.5 55.58,24.98 v55.55,24.95 | v55.55,24.95 | v52.01,25.06 51.89,25.18 39.22,25.18 v38.18,26.22 | U$3.PIN7 33.12,36.33 34.04,35.42 35.94,35.42 36.34,35.82 38.07,35.82 39.06,34.83 40.13,34.83 v40.44,35.15
  Top 0.254: U1.31 55.58,25.5 | 30.76,18.55 29.09,18.55 28.39,19.25
  Bottom 0.203: v25.08,22.93 23.32,24.69 22.83,24.69 14.39,33.13 v14.39,34.19 | 38.18,26.32 38.81,26.95 38.81,30.11 41.32,32.62 42.06,32.62 U$2.1 41.57,34.02 v40.44,35.15 | 38.18,26.32 v35.61,23.75 | v32.13,20.97 32.13,18.1 v32.18,18.05 | v55.55,24.95 52.12,24.95 v52.01,25.06 | v38.18,26.22 38.18,26.32
MOSI  (via drill 0.5)
  Top 0.203: 28.95,19.81 28.83,19.92 28.14,19.92 26.05,22.01 v26.05,23.85 | STM32.41 13.03,33.74 13.72,33.74 14.12,33.34 v15.2,33.34 | v37.15,23.75 36.09,22.7 34.49,22.7 33.32,21.53 v33.32,21.16 | J1.19 34.83,14.11 v34.83,18.03 33.76,19.09 32.76,19.09 | U1.37 63.2,27.67 60.85,30.02 56.39,30.02 52.6,33.82 v52.6,34.87 51.99,35.47 51.99,39.64 v52.75,40.39 | U$3.PIN3 37.52,38.85 40.18,41.51 44.08,41.51 45.39,42.81 47.24,42.81 47.4,42.66 50.8,42.66 v51.74,41.73
  Top 0.254: 28.95,19.81 29.66,19.09 32.76,19.09
  Bottom 0.203: v26.05,23.85 24.83,25.07 22.99,25.07 15.2,32.86 v15.2,33.34 | 56.73,36.87 56.1,36.25 56.1,34.96 55.44,34.3 52.62,34.3 | 52.62,34.3 49.24,34.3 47.18,32.24 41.48,32.24 39.2,29.96 39.2,25.8 v37.15,23.75 | v33.32,21.16 34.83,19.66 v34.83,18.03 | v52.6,34.87 52.62,34.85 52.62,34.3 | v51.74,41.73 52.75,40.72 v52.75,40.39
  Bottom 0.254: U$2.12 57.87,38.02 56.73,36.87
N$2
  Top 0.508: CT1.P$2 36.05,58.7 RB1.1 R5.1 32.27,52.27 25.62,52.27 RF1.1
N$6
  Top 0.203: R9.1 42.63,17.34 Q2.1
N$7
  Top 0.203: R11.1 43.53,22.01 Q1.1
N$8
  Top 0.508: CT2.P$2 23.27,58.75 RB2.1 R6.1 22.58,54.39 19.58,51.39 RF2.1
N$10
  Top 0.508: CT3.P$2 10.5,58.84 RB3.1 | R7.1 RB3.1 | RF3.1 15.01,52.53 14.13,53.41 RB3.1
N$13
  Top 0.406: R12.1 60.39,14.75 LED2.A
N$18
  Bottom 1.016: U$2.8 59.45,50.73 arc-90 62.12,53.4 SMA.1
N$41
  Top 0.508: R3.1 2.52,33.83 LED1.A
NRST
  Top 0.203: BOOT1.1 16.71,23.93 C2.2 15.04,23.29 15.04,26.6 16.61,28.18
  Top 0.254: 16.61,28.18 16.72,29.24 16.13,29.83 16.13,31.99 17.71,33.57 18.61,33.57 STM32.7
PULSE
  Top 0.254: STM32.43 12.02,31.32 4.11,31.32 3.11,30.32 3.11,27.52 18.57,12.06 21.34,12.06 C16.1 23.62,9.78 PULSE.2
RFM_IRQ  (via drill 0.5)
  Top 0.203: STM32.11 21.2,33.81 21.44,33.81 21.91,34.29 21.91,34.97 v22.03,35.09 | v31.54,32.43 30.03,32.43 28.13,34.33 28.13,36.5 27.36,37.26 v25.74,37.26 | v41.28,35.92 41.28,34.84 40.83,34.39 38.22,34.39 v37.57,35.03 34.88,35.03 v34.01,33.84 | v36.21,25.51 35.88,25.18 34.62,25.18 33.79,24.35 v33.33,24.35 | v38.18,16.69 38.63,16.24 38.63,12.83 J1.16
  Bottom 0.203: v22.03,35.09 24.21,35.09 25.74,36.62 v25.74,37.26 | v34.01,33.84 32.28,32.43 v31.54,32.43 | v41.28,35.92 43.36,35.92 U$2.2 | v37.57,35.03 38,34.6 38,31.79 36.21,30 v36.21,25.51 | v33.33,24.35 33.33,23.9 34,23.23 35.01,23.23 35.41,22.83 36.21,22.83 37,22.04 37,20.84 36.42,20.27 36.42,19.29 36.47,19.24 36.47,17.64 37.43,16.69 v38.18,16.69
RFM_RST  (via drill 0.5)
  Top 0.203: v39.74,44.36 39.73,44.2 v36.02,40.66 | STM32.12 21.04,35.19 22.11,36.27 22.11,38.46 23.94,40.28 24.95,40.26 25.64,39.58 29.36,39.59 30.57,40.8 33.35,40.8 33.33,40.82 v33.33,41.04 | J1.18 36.09,12.83 36.09,15.24 35.77,15.56 v35.77,18.95 | v32.24,23.9 32.24,24.7 34.04,26.49 36.81,26.49 v37.08,26.22
  Bottom 0.203: U$2.6 43.11,44.36 v39.74,44.36 | v33.33,41.04 35.49,41.04 v36.02,40.66 38.38,38.29 38.38,31.49 36.68,29.78 36.68,26.62 v37.08,26.22 | v35.77,18.95 35.77,20.15 36.62,21 36.62,21.86 36.03,22.45 35.26,22.45 34.86,22.85 33.71,22.85 32.66,23.9 v32.24,23.9
RPI_CONNECTED  (via drill 0.5)
  Top 0.203: v38.32,18.95 38.16,18.95 37.25,18.04 R8.2 | STM32.2 18.2,30.45 18.2,28.88 16.73,27.41 16.73,26.35 20,23.07 v20,21.39 | v23.83,15.72 23.31,16.23 23.31,22.22 25.75,24.66 31.6,24.66 33.93,27 42.67,27 v43.03,26.64 | v42.85,30.33 43.1,30.58 45.45,28.23 49.01,28.23 49.23,28 U1.26
  Bottom 0.203: v38.32,18.95 38.32,20.8 39.44,21.92 41.47,21.92 43.03,23.48 v43.03,26.64 43.03,27.33 43.02,27.34 43.02,30.17 v42.85,30.33 | v20,21.39 19.13,20.51 19.1,20.51 19.1,19.53 19.45,19.18 20.74,19.18 22.21,17.71 22.21,16.45 22.95,15.72 v23.83,15.72
RPI_CONNECTED_PR
  Top 0.254: J1.17 37.36,15.98 R8.1
RPI|ESP_CS  (via drill 0.5)
  Top 0.203: 53.04,25.27 53.04,24.8 52.05,23.8 51.28,23.8
  Top 0.254: J1.24 JP6.1 | v30.89,20.88 34.79,24.78 50.3,24.78 51.28,23.8 | U1.29 53.04,25.27
  Bottom 0.254: J1.24 29.42,11.56 28.01,12.97 28.01,18 v30.89,20.88
RST_STM  (via drill 0.5)
  Top 0.203: JP2.1 4.68,44.41 v6.24,42.84 | R4.1 19.41,20.08 v20.31,20.08 | v27.45,23.49 27.73,23.21 27.73,22.4 30.07,20.07 38.68,20.07 v39.22,20.6
  Top 0.254: R4.1 18.45,20.9 17.39,21.96 C2.1 17.72,21.23 17.67,21.18 17.21,20.72 v17.21,20.69 | JP2.1 2.75,44.41 1.36,43.03 1.36,38.63 STLINK.3
  Bottom 0.203: v20.31,20.08 24.38,20.08 25.41,21.11 25.41,22.12 26.77,23.49 v27.45,23.49 | v39.22,20.6 39.22,17.55 40.1,16.66 42.46,16.66 44.98,14.14 J1.11
  Bottom 0.254: v17.21,20.69 12.37,20.69 9.96,23.11 9.96,36.51 7.62,38.85 7.62,41.47 v6.24,42.84
SCL  (via drill 0.5)
  Top 0.203: 31.6,27.77 v31.77,27.77
  Top 0.229: STM32.45 11.43,29.32 v11.14,29.32 | v11.18,23.21 11.18,21.61 16.41,16.73 17.84,16.73 v17.87,16.77 | v21.11,17.22 21.44,17.54 21.44,22.52 26.68,27.77 31.6,27.77 | v44.91,27.53 43.71,27.53 43.47,27.77 v34.15,27.77 | v51.68,29.72 51.81,29.59 60.33,29.59 62.05,27.87 62.05,26.82
  Top 0.254: v55.44,16.82 55.44,15.92 55.18,15.66 54.15,15.66 J1.5 | v59.34,18.9 59.78,18.9 62.05,21.18 62.05,26.82 U1.36
  Bottom 0.203: v31.77,27.77 v34.15,27.77
  Bottom 0.229: v11.14,29.32 10.73,28.91 10.73,27.63 11.27,27.09 11.27,23.3 v11.18,23.21 | v17.87,16.77 17.87,17.16 18.27,17.56 20.03,17.56 20.37,17.22 v21.11,17.22 | v44.91,27.53 45.38,28.01 45.38,28.54 46.55,29.7 51.67,29.7 v51.68,29.72
  Bottom 0.254: v59.34,18.9 57.59,18.9 55.51,16.82 v55.44,16.82
SDA  (via drill 0.5)
  Top 0.203: v31.53,28.91 31.5,28.91 30.76,28.17 | v34.3,28.94 34.3,28.88 34.79,28.38
  Top 0.229: STM32.46 11.86,29.04 11.86,29.02 11.52,28.68 v11.52,28.12 | v12.18,22.21 12.18,21.81 16.36,17.63 v16.71,17.63 | v20.03,18.3 21.03,19.3 21.03,22.77 26.43,28.17 30.76,28.17 | v44.11,28.36 44.09,28.38 34.79,28.38 | v50.46,30.45 50.46,28.94 57.63,28.94 58.12,28.45 U1.33
  Top 0.254: J1.3 57.11,16.08 v57.11,16.38 | v58.3,18.16 58.12,18.89 U1.33
  Bottom 0.203: v31.53,28.91 34.27,28.91 v34.3,28.94
  Bottom 0.229: v11.52,28.12 11.52,27.52 12.21,26.82 12.21,22.25 v12.18,22.21 | v16.71,17.63 17.18,17.96 19.69,17.96 v20.03,18.3 | v44.11,28.36 44.58,28.83 45.1,28.83 46.38,30.11 50.23,30.11 50.46,30.34 v50.46,30.45
  Bottom 0.254: v57.11,16.38 58.67,17.93 v58.3,18.16
SPI3_NSS  (via drill 0.5)
  Top 0.203: 27.45,18.08 v27.2,17.82 26.88,18.15 26.88,19.56 25.48,20.96 24.06,20.96 v24.04,20.94 | v12.45,35.29 v12.45,35.28 STM32.38 | v35.66,21.5 38.15,21.5 v40.23,23.59
  Top 0.254: JP6.2 28.88,8.5 28.03,9.35 28.03,17.5 27.45,18.08
  Bottom 0.203: v24.04,20.94 22.18,22.81 22.18,24.26 12.45,34 v12.45,35.29 | U$2.14 56.25,34.02 55.53,33.29 51.08,33.29 49.26,31.48 41.79,31.48 39.96,29.64 39.96,27.61 40.23,27.34 v40.23,23.59 | v35.66,21.5 34.7,22.47 30.03,22.47 26.88,19.31 26.88,18.15 v27.2,17.82
SPI_CLK  (via drill 0.5)
  Top 0.203: 27.84,18.72 v27.71,18.85 27.71,19.27 25.27,21.71 | STM32.39 12.42,34.55 13.08,34.55 v13.54,35.01 | v24.2,22.05 24.93,22.05 25.27,21.71 | 25.27,21.71 | v34.47,21.61 35.19,22.32 37.25,22.32 v38.68,23.75 39.26,24.33 50.09,24.33 51.33,23.09 53.64,23.09 54.31,23.77 54.31,24.94 | U$3.PIN5 35.33,37.08 36.05,36.36 40.07,36.36 40.54,36.83 40.54,38.63 40.02,39.16 v39.74,39.16 | v40.48,40.65 40.87,41.04 44.24,41.04 45.64,42.43 47.09,42.43 47.24,42.28 49.76,42.28 51.21,40.83 51.21,40.4 51.17,40.35 51.17,35.14 49.58,33.55 v49.5,33.55
  Top 0.254: 27.84,18.72 29.74,16.83 J1.23 | U1.30 54.31,24.94
  Bottom 0.203: v24.2,22.05 22.56,23.68 22.56,24.42 13.54,33.44 v13.54,35.01 | U$2.13 57.71,36.02 55.5,33.8 50.82,33.8 50.37,33.35 | 50.37,33.35 48.88,31.86 41.64,31.86 39.58,29.8 39.58,24.65 v38.68,23.75 | v34.47,21.61 34.04,22.04 30.9,22.04 v27.71,18.86 v27.71,18.85 | v39.74,39.16 40.37,39.16 40.48,39.27 v40.48,40.65 | v49.5,33.55 50.16,33.55 50.37,33.35
STM_RX  (via drill 0.5)
  Top 0.203: 5.74,45.75 1.96,45.75 1.2,46.52 1.2,48.09 2.6,49.49 JP2.3 | U1.28 51.46,27.26 51.46,28.15 51.27,28.34 50.44,28.34 49.76,29.02 45.85,29.02 44.12,30.74 44.12,31.18 43.65,31.65 34.6,31.65 | 34.6,31.65 | 34.6,31.65 v34.6,32 | v20.02,35.54 19.75,35.81 19.75,36.53 19.1,37.17 17.96,37.17 17.22,36.44 v17.22,36.12 | v13.42,37.25 13.42,37.99 STM32.31
  Top 0.254: STM32.31 12.9,38.59 5.74,45.75 | J1.8 50.06,9.74 v48.13,7.82 | v48.02,0.96 47.5,0.43 47.5,0.23 37.53,0.23 37.05,0.71 8.12,0.71 5.79,3.05 5.79,5.22 1.47,9.54 1.47,24.98 v2.07,25.58
  Bottom 0.203: 1.52,43.09 1.51,43.11 1.51,43.91 1.49,43.93 1.49,48.22 2.76,49.49 JP2.3 | v34.6,32 35.28,32.69 35.28,34.35 32.53,37.1 26.87,37.1 23.65,33.89 21.67,33.89 v20.02,35.54 | v17.22,36.12 16.79,36.12 15.65,37.25 v13.42,37.25
  Bottom 0.254: v48.13,7.82 48.13,7.79 47.73,7.39 47.73,1.25 v48.02,0.96 | v2.07,25.58 2.18,25.69 2.18,28.02 2.21,28.04 1.81,28.44 1.81,35.63 1.52,35.91 1.52,43.09
STM_TX  (via drill 0.5)
  Top 0.203: v7.49,45.83 6.98,45.31 6.87,45.31 | JP2.2 4.27,46.95 4.3,46.92 | U1.27 50.1,27.34 50.1,28.04 49.52,28.62 45.66,28.62 43.74,30.55 43.74,30.82 43.29,31.27 34.6,31.27 v34.6,30.92 | v19.25,34.77 19.25,36.26 19.36,36.38 18.95,36.79 18.11,36.79 18.11,36.75 v18.4,36.47 | v14.27,38.2 13.98,38.2 STM32.30
  Top 0.254: STM32.30 6.87,45.31 5.26,46.92 4.3,46.92 | J1.10 47.52,9.71 46.86,9.05 v46.86,8.02 | v46.57,1.09 46.57,1.04 46.19,0.66 37.71,0.66 37.23,1.14 8.3,1.14 6.22,3.23 6.22,5.51 1.9,9.83 1.9,24 2.64,24.75 v3.02,24.37
  Bottom 0.203: v7.49,45.83 7.49,45.76 4.92,43.19 2.23,43.19 1.97,42.93 1.97,42.87 | v34.6,30.92 33.89,31.63 33.89,32.37 34.76,33.24 34.76,34.32 32.36,36.72 27.03,36.72 23.81,33.51 20.52,33.51 v19.25,34.77 | v18.4,36.47 17.83,37.03 16.41,37.03 15.81,37.63 14.84,37.63 v14.27,38.2
  Bottom 0.254: v46.86,8.02 46.86,1.38 v46.57,1.09 | 1.97,42.87 1.97,36.07 2.24,35.8 2.24,28.62 2.87,27.99 2.87,27.75 3.02,27.6 v3.02,24.37
SWCLK
  Top 0.254: STM32.37 8.03,34.68 3.43,39.28 STLINK.2
SWDIO
  Top 0.254: STLINK.1 8.79,41.82 11.53,39.08 11.53,38.51 11.28,38.26 11.28,38.07 STM32.34
VSIG
  Top 0.254: STM32.20 20.98,41.7 20.98,43.38 23.01,45.41 26.42,45.41 CFV.1
  Top 0.508: RFV.2 CFV.1

### Text on the board
tPlace: GND | 5V | Open-Hardware | Rx | Tx | RST | DIO | CLK | RST | Tx | Rx | emonSTM32mini | Development Board | OpenEnergyMonitor | Designed in | North Wales | Made in UK | v0.3 | by DB | GND | DS18B20 | 3V3 | GND | PULSE | 3V3
tValues: 74.04 y axis / 71.39 x axis | GND | T | 3V3 | GND | P | 3V3 | DS18B20 | PULSE INPUT